# Altium schematic sheet InputPower.SchDoc
size A3; SheetNumber: 1; SheetTotal: 4
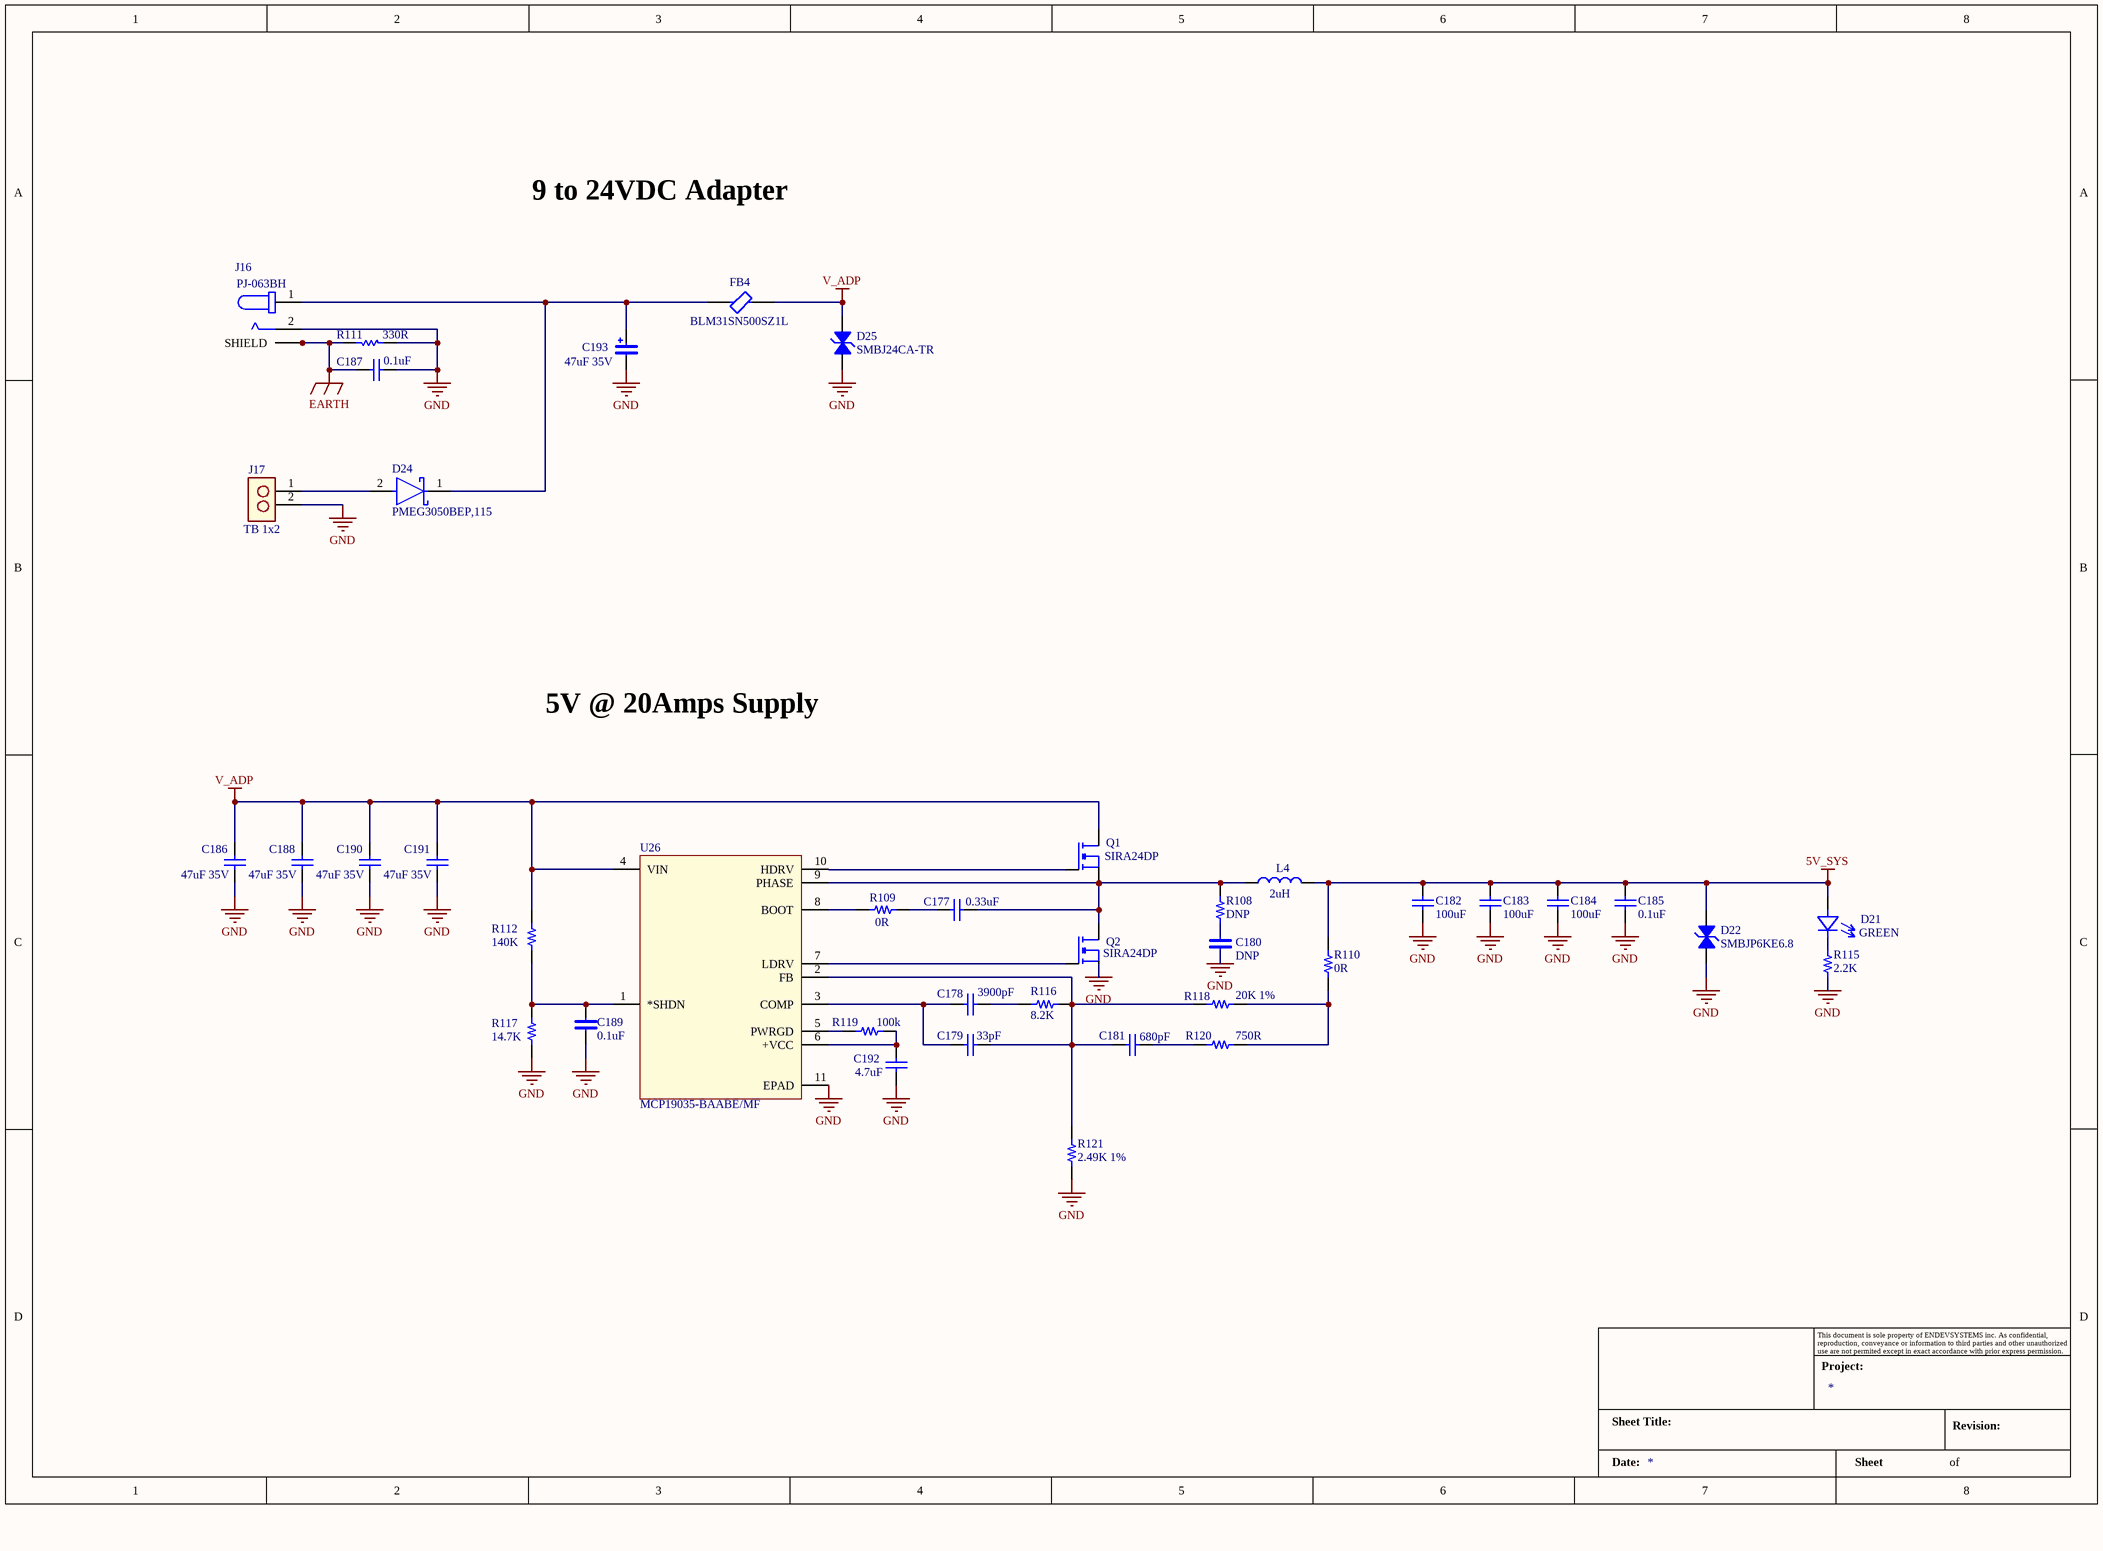
[diagram p0: InputPower.SchDoc]

## Parts
?  Title_Block  (value not drawn)  (graphical)
C177  0.33uF  [C-0805/2012]
C178  3900pF  [C-0805/2012]
C179  33pF  [C-0805/2012]
C180  DNP  [CAP 1206/3216]
C181  680pF  [C-0805/2012]
C182  100uF  [C-0805/2012]
C183  100uF  [C-0805/2012]
C184  100uF  [C-0805/2012]
C185  0.1uF  [C-0805/2012]
C186  47uF 35V  [C-0805/2012]
C187  0.1uF  [C-0603/1608]
C188  47uF 35V  [C-0805/2012]
C189  0.1uF  [CAP 1206/3216]
C190  47uF 35V  [C-0805/2012]
C191  47uF 35V  [C-0805/2012]
C192  4.7uF  [C-0805/2012]
C193  47uF 35V  [C-1206 (Tantalum)]
D21  GREEN  [SOIC-8 (W3.9mm) B]
D22  SMBJP6KE6.8  [DO-214AA\SMB]
D24  PMEG3050BEP,115  [FP-SOD128-MFG]
D25  SMBJ24CA-TR  [DO-214AA\SMB]
FB4  BLM31SN500SZ1L  [FP-BLM31-0_2-t1_1-MFG]
J16  PJ-063BH  [CUI_PJ-063BH]
J17  TB 1x2  [Terminal Block-1x2-5.08mm]
L4  2uH  [4.3x4.3mm]
Q1  SIRA24DP
Q2  SIRA24DP
R108  DNP  [R-0402]
R109  0R  [R-0402]
R110  0R  [R-0402]
R111  330R  [R-0603/1608]
R112  140K  [R-0402]
R115  2.2K  [R-0402]
R116  8.2K  [R-0402]
R117  14.7K  [R-0402]
R118  20K 1%  [R-0402]
R119  100k  [R-0402]
R120  750R  [R-0402]
R121  2.49K 1%  [R-0402]
U26  MCP19035-BAABE/MF  [DFN10_3x3MC_MCH]

## Nets
5V_SYS: C182.1 C183.1 C184.1 C185.1 D21.A D22.2 L4.2 R110.2
EARTH: C187.2 J16.S1(SHIELD) J16.S2(SH) R111.2
GND: C180.1 C182.2 C183.2 C184.2 C185.2 C186.1 C187.1 C188.1 C189.1 C190.1 C191.1 C192.2 C193.- D22.1 D25.1 J16.2 J17.2 Q2.2(S) R111.1 R115.1 R117.2 R121.1 U26.11(EPAD)
V_ADP: C186.2 C188.2 C190.2 C191.2 D25.2 FB4.2 Q1.3(D) R112.1 U26.4(VIN)
NetC177_1: C177.1 L4.1 Q1.2(S) Q2.3(D) R108.1 U26.9(PHASE)
NetC177_2: C177.2 R109.2
NetC178_1: C178.1 R116.1
NetC178_2: C178.2 C179.2 U26.3(COMP)
NetC179_1: C179.1 C181.2 R116.2 R118.1 R121.2 U26.2(FB)
NetC180_2: C180.2 R108.2
NetC181_1: C181.1 R120.1
NetC189_2: C189.2 R112.2 R117.1 U26.1(*SHDN)
NetC192_1: C192.1 R119.2 U26.6(+VCC)
NetC193_+: C193.+ D24.1(C) FB4.1 J16.1
NetD21_C: D21.C R115.2
NetD24_2: D24.2(A) J17.1
NetQ1_1: Q1.1(G) U26.10(HDRV)
NetQ2_1: Q2.1(G) U26.7(LDRV)
NetR109_1: R109.1 U26.8(BOOT)
NetR110_1: R110.1 R118.2 R120.2
NetR119_1: R119.1 U26.5(PWRGD)

## Notes on the sheet
- 9 to 24VDC Adapter
- 5V @ 20Amps Supply
- (in symbol Title_Block) This document is sole property of ENDEVSYSTEMS inc. As confidential, reproduction, conveyance or information to third parties and other unauthorized use are not permited except in exact accordance with prior express permission.; Project:; Sheet Title:; Revision:; Date:; Sheet; of

## Library data of the parts
C177-C179 C181-C184 C186 C188 C190-C192 = Cap: Capacitor; Value: 0.1uF; Published: 8-Jun-2000; LatestRevisionDate: 17-Jul-2002; LatestRevisionNote: Re-released for DXP Platform.; PackageReference: RAD-0.3; Publisher: Altium Limited; PackageDescription: Radial Cap, Thru-Hole; 2 Leads; 0.3 in Pin Spacing
C180 C189 = CAP 1206/3216: CAP CER 10UF 25V X5R 1206; Mfr. Part No.: C1206C106M3PACTU; Unit Price (USD): 0.28; Supplier Part No.: 399-8153-1-ND; Supplier: Digikey Electronics
C185 C187 = Cap: Capacitor; Published: 8-Jun-2000; LatestRevisionDate: 17-Jul-2002; LatestRevisionNote: Re-released for DXP Platform.; PackageReference: RAD-0.3; Publisher: Altium Limited; PackageDescription: Radial Cap, Thru-Hole; 2 Leads; 0.3 in Pin Spacing; Value: 0.1uF
C193 = Capacitor-Polar: CAP TANT 10UF 10% 16V 1206; Mfr. Part No.: F931C106KAAAJ6; Unit Price (USD): 0.67; Value: 10uF 16V; Supplier Part No.: 478-10723-1-ND; Supplier: Digikey Electronics
D21 = Diode-LED: Supplier: Digikey Electronics
D22 D25 = ACPDQC3V3T-HF: TVS DIODE 3.3V 9.8V 0402C; Unit Price (USD): 0.41; Mfr. Part No.: ACPDQC3V3T-HF; Supplier Part No.: 641-1635-1-ND; Supplier: Digikey Electronics
D24 = CMP-14398-000032-1: DIODE SCHOTTKY 30V 5A SOD128; RoHS Compliant: Yes
FB4 = CMP-06046-002359-1: Chip Ferrite Bead Array, 1206, 50Ω @ 100MHz, 0.0016Ω, ±12.5Ω, 12A; Number of Lines: 1; DC Resistance (DCR): 1.6mR; Max Current Rating: 12A; Case Code (Metric): 3216; Package Quantity: 3000; Height: 0.051inch; RoHS Compliant: Yes; Case/Package: 1206; Mount: Surface Mount; Case Code (Imperial): 1206; Width: 0.063inch; Length: 0.126inch; Max Operating Temperature: 125°C; Ratings: AEC-Q200; Packaging: Tape and Reel; Min Operating Temperature: -55°C
J16 = PJ-063BH: 2.5 mm Center Pin, 8.0 A, Right Angle, Through Hole, Shielded, Kinked Pins, Dc Power Jack Connector; Value: *; Price: None; MP: PJ-063BH; Availability: Unavailable; Package: None
J17 = T-BLOCK-1x2: Supplier: Digikey Electronics
L4 = 4.3x4.3mm: FIXED IND 22UH 620MA 350 MOHM; Mfr. Part No.: ASPI-4020S-220M-T; Unit Price (USD): 0.48; Supplier Part No.: 535-12307-1-ND; Value: 22uH; Supplier: Digikey Electronics
Q1 Q2 = MOSFET-N: Supplier: Digikey Electronics
R108-R110 R112 R115-R121 = Resistor: RES SMD 51 OHM 0.5% 1/16W 0402; Mfr. Part No.: ERA-2AED510X; Value: 51R; Unit Price (USD): 0.21; Supplier Part No.: P51DECT-ND; Supplier: Digikey Electronics
R111 = Res1: Resistor; Value: 10K; Published: 8-Jun-2000; LatestRevisionDate: 17-Jul-2002; LatestRevisionNote: Re-released for DXP Platform.; PackageReference: AXIAL-0.3; Publisher: Altium Limited; PackageDescription: Axial Device, Thru-Hole; 2 Leads; 0.3 in Pin Spacing
U26 = MCP19035-BAABEMF: No Description Available; Mfr_Name: Microchip; RefDes: RefDes; Type: Type
? = Title_Block: Date:: *; Project:: *